# EAGLE design pPump1 (EAGLE 8.2.0)
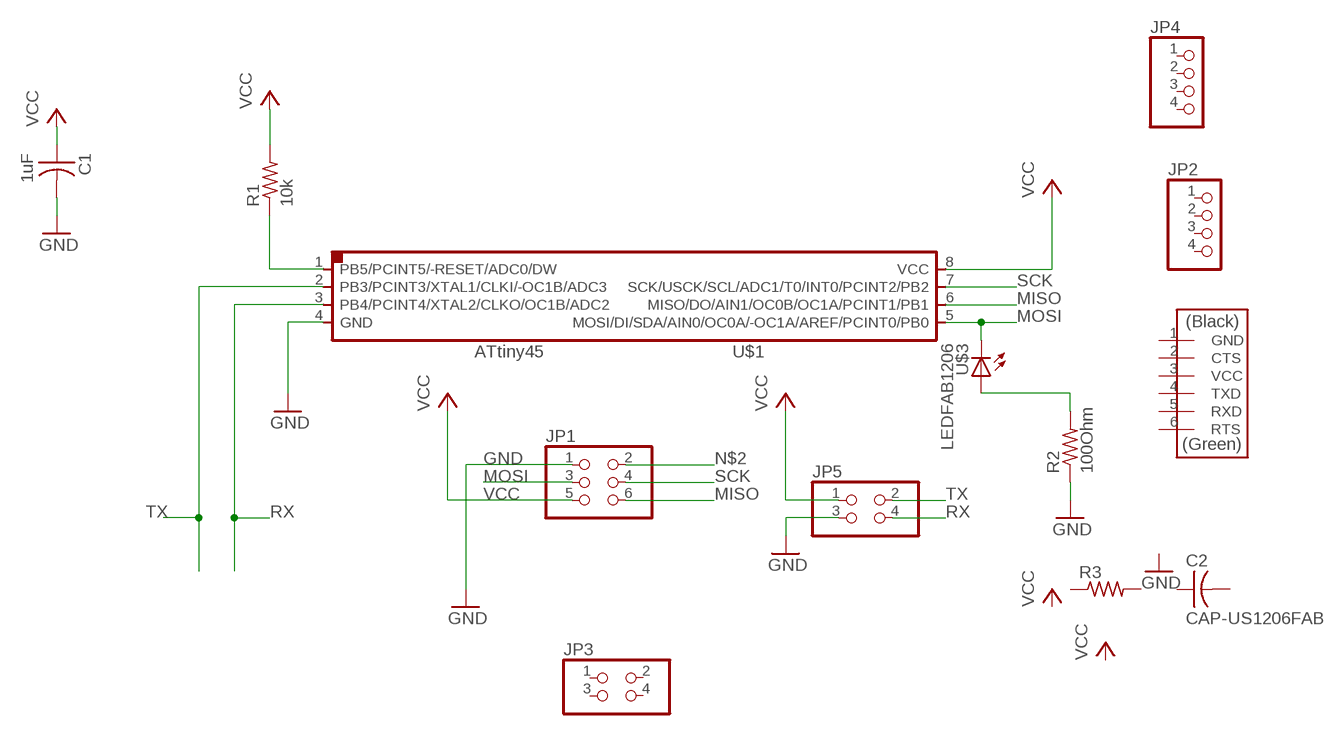
[diagram p0: schematic, sheet 1]

## Parts
C1  1uF  CAP-US1206FAB  [C1206FAB]
C2  CAP-US1206FAB  [C1206FAB]
JP1  PINHD-2X3-SMD  [2X03SMD]
JP2  PINHD-1X4  [1X04]
JP3  PINHD-2X2  [2X02]
JP4  PINHD-1X4/90  [1X04/90]
JP5  PINHD-2X02_2.54-SMD  [2X02SMD]
R1  10k  RES-US1206FAB  [R1206FAB]
R2  100Ohm  RES-US1206FAB  [R1206FAB]
R3  RES-US1206FAB  [R1206FAB]
U$1  ATTINY45SI  [SOIC8]
U$2  FTDI-SMD-HEADER  [1X06SMD]
U$3  LEDFAB1206  [LED1206FAB]

## Nets
GND: C1.2 JP1.1 JP5.3 R2.1 U$1.4(GND)
MISO: JP1.6 U$1.6(MISO/DO/AIN1/OC0B/OC1A/PCINT1/PB1)
MOSI: JP1.3 U$1.5(MOSI/DI/SDA/AIN0/OC0A/-OC1A/AREF/PCINT0/PB0) U$3.2(C)
N$1: R2.2 U$3.1(A)
N$2: JP1.2
N$3: R1.1 U$1.1(PB5/PCINT5/-RESET/ADC0/DW)
RX: JP5.4 U$1.3(PB4/PCINT4/XTAL2/CLKO/OC1B/ADC2)
SCK: JP1.4 U$1.7(SCK/USCK/SCL/ADC1/T0/INT0/PCINT2/PB2)
TX: JP5.2 U$1.2(PB3/PCINT3/XTAL1/CLKI/-OC1B/ADC3)
VCC: C1.1 JP1.5 JP5.1 R1.2 U$1.8(VCC)
Unconnected: C2.1 C2.2 JP2.1 JP2.2 JP2.3 JP2.4 JP3.1 JP3.2 JP3.3 JP3.4 JP4.1 JP4.2 JP4.3 JP4.4 R3.1 R3.2 U$2.1(GND) U$2.2(CTS) U$2.3(VCC) U$2.4(TXD) U$2.5(RXD) U$2.6(RTS)

## Library data of the parts
C1 C2 = fab:CAP-US
JP1 = fab:PINHD-2X3-SMD: PIN HEADER
JP2 = RepRapjr:PINHD-1X4: PIN HEADER
JP3 = pinhead:PINHD-2X2: PIN HEADER
JP4 = pinhead:PINHD-1X4: PIN HEADER
JP5 = untitled:PINHD-2X02: PIN HEADER
R1-R3 = fab:RES-US: Resistor (US Symbol) Variants with postfix FAB are widened to allow the routing of internal traces
U$1 = fab:ATTINY45
U$2 = fab:FTDI-SMD-HEADER
U$3 = fab:LED: LED

## Board
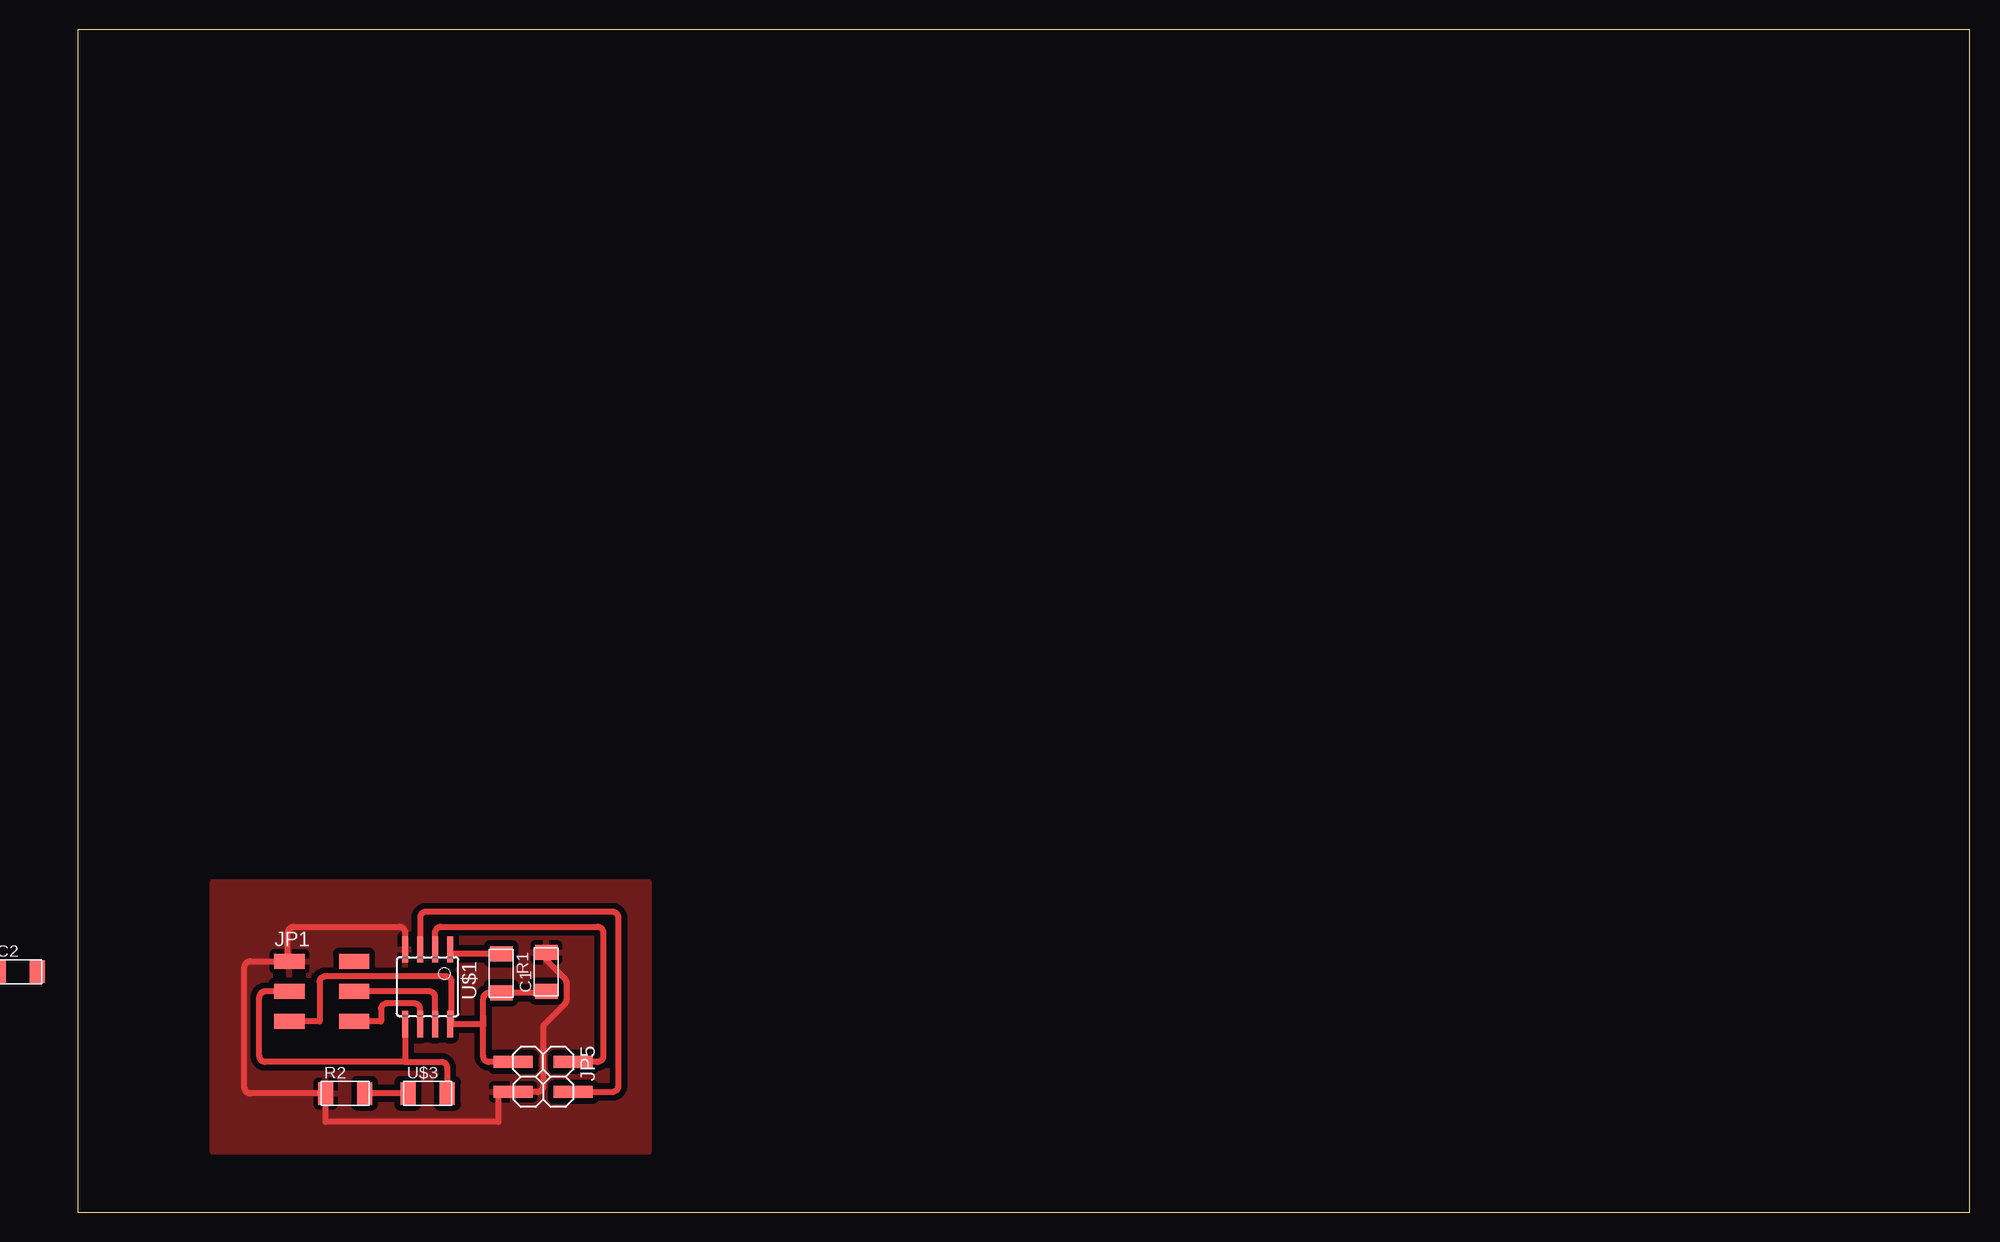
[diagram p1: board, top side]

Size 160 x 100 mm. Coordinates in mm from the lower left corner, seen from the top.
Outline: 0,0 160,0 160,100 0,100 0,0
Copper layers (1*16): Top 0.035mm / dielectric 1.5mm / Bottom 0.035mm
Design rules "default *": minimum track width 0.5mm, minimum drill 0.35mm, track to track 0.5mm, track to pad 0.5mm, pad to pad 0.5mm, via to via 0.5mm, smd to smd 0.5mm, copper to edge 0.5mm, drill to drill 6mil, minimum pad ring 10mil, minimum via ring 8mil, stop-mask expansion 4mil, vias tented up to drill 0mil, thermal gap 0.4mm

### Footprints (pad centres in the part's own frame; a part is rotated, then mirrored left to right if it is on the bottom)
C1206FAB = smd 1.27 x 1.905: 1 -1.651,0; 2 1.651,0
2X03SMD = smd 2.54 x 1.27: 1 -2.54,2.54; 2 2.92,2.54; 3 -2.54,0; 4 2.92,0; 5 -2.54,-2.54; 6 2.92,-2.54
1X04 = drill 1.016: 1 -2.54,0; 2 0,0; 3 2.54,0; 4 5.08,0
2X02 = drill 1.016 octagon: 1 -1.27,-1.27; 2 -1.27,1.27; 3 1.27,-1.27; 4 1.27,1.27
1X04/90 = drill 1.016 long: 1 -3.81,-3.81; 2 -1.27,-3.81; 3 1.27,-3.81; 4 3.81,-3.81
2X02SMD = smd 1.016 x 3.302: 1 -1.27,-3.81; 2 -1.27,1.27; 3 1.27,-3.81; 4 1.27,1.27
R1206FAB = smd 1.27 x 1.905: 1 -1.651,0; 2 1.651,0
SOIC8 = smd 0.5 x 2.2: 1 -1.905,-3.154; 2 -0.645,-3.154; 3 0.625,-3.154; 4 1.895,-3.154; 5 1.905,3.154; 6 0.635,3.154; 7 -0.635,3.154; 8 -1.905,3.154
1X06SMD = smd 2.54 x 1.27: 1 0,6.35; 2 0,3.81; 3 0,1.27; 4 0,-1.27; 5 0,-3.81; 6 0,-6.35
LED1206FAB = smd 1.27 x 1.905: 1 -1.651,0; 2 1.651,0

### Placement (x,y rotation side)
C1  39.62,20.32 90 top
C2  -5.08,20.32 0 top  (outside the outline)
JP1  20.45,18.67 0 top
JP2  -36.83,31.75 0 top  (outside the outline)
JP3  -19.43,25.15 270 top  (outside the outline)
JP4  -24.13,6.35 0 top  (outside the outline)
JP5  40.64,11.43 270 top
R1  35.81,20.19 270 top
R2  22.61,10.03 0 top
R3  -15.24,38.1 0 top  (outside the outline)
U$1  29.59,19.05 180 top
U$2  -39.37,7.62 0 top  (outside the outline)
U$3  29.59,10.03 0 top

### Tracks (layer width: path | path; a pad name or v marks a point on that pad's centre or on a via)
GND
  Top 0.5: U$1.4 27.7,23.63 arc90 27.2,24.13 18.28,24.13 arc90 17.78,23.63 17.78,21.34 arc90 JP1.1 14.6,21.21 arc90 14.1,20.71 14.1,10.53 arc90 14.6,10.03 R2.1 20.95,7.62 35.56,7.62 35.56,10.16 JP5.3 38.87,10.16 arc90 39.37,10.66 39.37,15.77 41.18,17.58 arc45 41.33,17.93 41.33,19.41 arc45 41.18,19.76 39.62,21.32 C1.2
  pour Top: 11.43,27.94 48.26,27.94 48.26,5.08 11.43,5.08
MISO
  Top 0.5: U$1.6 28.96,17.15 arc90 28.46,17.65 26.15,17.65 arc90 25.65,17.15 25.65,16.13 JP1.6
MOSI
  Top 0.5: JP1.3 15.87,18.67 arc90 15.37,18.17 15.37,13.2 arc90 15.87,12.7 27.69,12.7 | 27.69,12.7 30.74,12.7 arc-90 31.24,12.2 U$3.2 | U$1.5 27.69,12.7
N$1
  Top 0.5: U$3.1 R2.2
N$3
  Top 0.5: 35.45,22.2 arc-90 R1.1 31.86,21.84 arc-90 U$1.1
RX
  Top 0.5: JP5.4 45.22,10.16 arc90 45.72,10.66 45.72,24.9 arc90 45.22,25.4 29.47,25.4 arc90 28.97,24.9 U$1.3
SCK
  Top 0.5: U$1.7 30.23,18.17 arc90 29.73,18.67 JP1.4
TX
  Top 0.5: U$1.2 arc-90 30.23,22.21 30.23,23.63 arc-90 30.73,24.13 43.95,24.13 arc-90 44.45,23.63 44.45,13.2 arc-90 43.95,12.7 JP5.2
VCC
  Top 0.5: C1.1 arc-90 39.5,18.54 R1.2 34.79,18.54 arc90 34.29,18.04 34.29,16.51 | 34.29,16.51 34.29,15.75 arc90 34.14,15.9 U$1.8 arc90 31.62,16.02 31.62,19.44 arc90 31.12,19.94 20.95,19.94 arc90 20.45,19.44 20.45,16.13 JP1.5 | JP5.1 34.79,12.7 arc-90 34.29,13.2 34.29,16.51